# EAGLE design FM Transmitter (EAGLE 9.6.2)
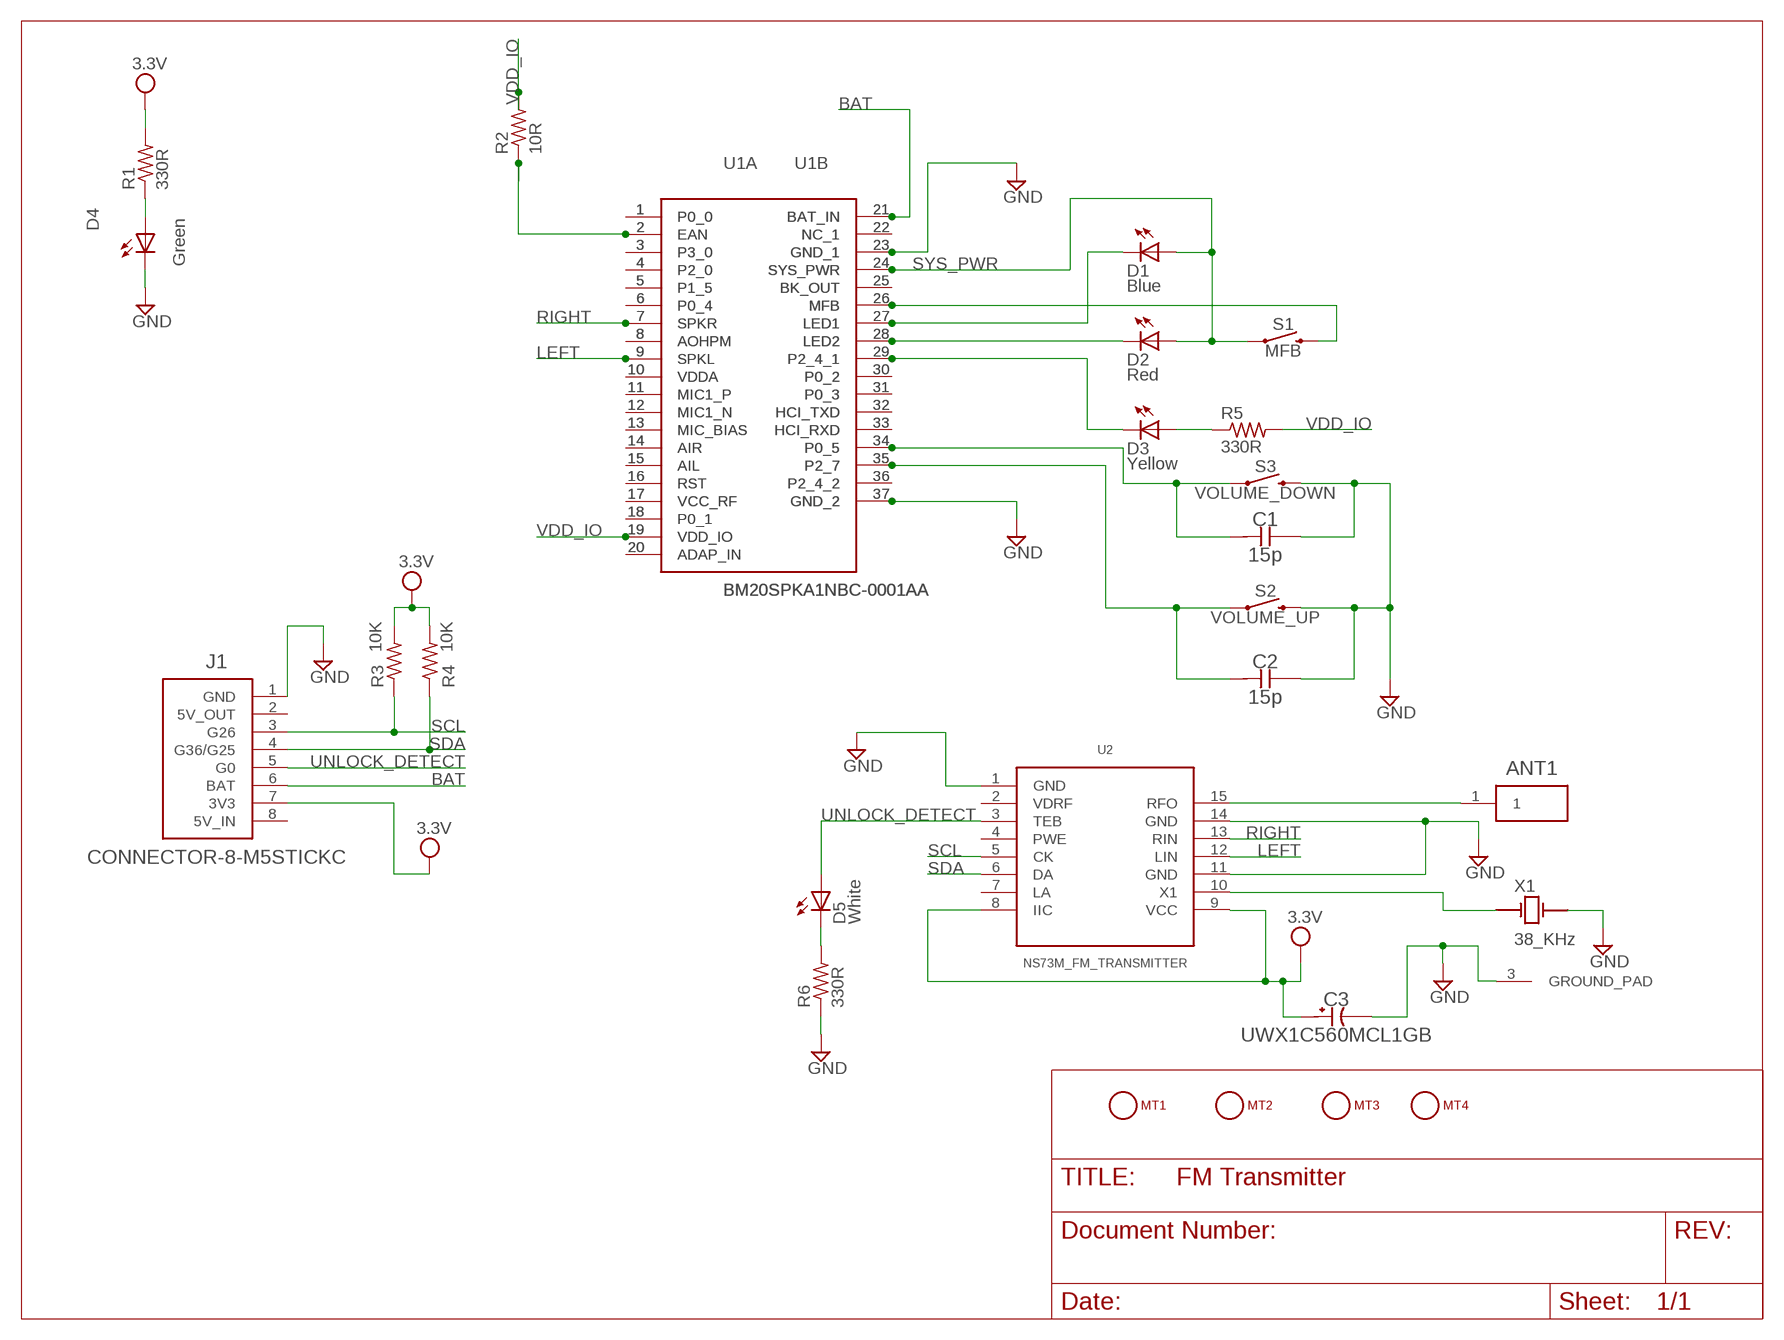
[diagram p0: schematic, sheet 1]

## Parts
ANT1  CONNECTOR-1  [ESQ-101-XX-X-S]
C1  15p  CAPACITOR-0805  [CAPC2012X140N]
C2  15p  CAPACITOR-0805  [CAPC2012X140N]
C3  UWX1C560MCL1GB  CAPACITOR_POLARIZED-6.3MM  [PCAP_6.3X5.4-ELECT-M]
D1  Blue  LED5MM  [LED5MM]
D2  Red  LED5MM  [LED5MM]
D3  Yellow  LED5MM  [LED5MM]
D4  Green  LED5MM  [LED5MM]
D5  White  LED5MM  [LED5MM]
J1  CONNECTOR-8-M5STICKC  [ESQ-108-XX-X-S]
MT1  MOUNTING_HOLE-125_250_ROUND  [MT_125_250]
MT2  MOUNTING_HOLE-125_250_ROUND  [MT_125_250]
MT3  MOUNTING_HOLE-125_250_ROUND  [MT_125_250]
MT4  MOUNTING_HOLE-125_250_ROUND  [MT_125_250]
R1  330R  R-US_R0805  [R0805]
R2  10R  R-US_R0805  [R0805]
R3  10K  R-US_R0805  [R0805]
R4  10K  R-US_R0805  [R0805]
R5  330R  R-US_R0805  [R0805]
R6  330R  R-US_R0805  [R0805]
S1  MFB  MOMENTARY-SWITCH-SPST-PTH-6.0MM  [TACTILE_SWITCH_PTH_6.0MM]
S2  VOLUME_UP  MOMENTARY-SWITCH-SPST-PTH-6.0MM  [TACTILE_SWITCH_PTH_6.0MM]
S3  VOLUME_DOWN  MOMENTARY-SWITCH-SPST-PTH-6.0MM  [TACTILE_SWITCH_PTH_6.0MM]
U1A  BM20SPKA1NBC-0001AA  [BM20SPKA1NBC0001AA]
U1B  BM20SPKA1NBC-0001AA  [BM20SPKA1NBC0001AA]
U2  NS73M_FM_TRANSMITTER  [NS73M]
X1  38_KHz  XTAL_38_KHZ_GROUND_PAD  [XTAL-WITH-GROUND-PAD]

## Nets
3.3V: C3.1 J1.7(3V3) R1.2 R3.2 R4.2 U2.8(IIC) U2.9(VCC)
BAT: J1.6(BAT) U1A.21(BAT_IN) U1B.21(BAT_IN)
GND: C1.2 C2.2 C3.2 D4.K(C) J1.1(GND) R6.1 S2.3 S3.3 U1A.23(GND_1) U1A.37(GND_2) U1B.23(GND_1) U1B.37(GND_2) U2.1(GND) U2.11(GND) U2.14(GND) X1.2 X1.3(GROUND_PAD)
LEFT: U1A.9(SPKL) U1B.9(SPKL) U2.12(LIN)
N$1: ANT1.1 U2.15(RFO)
N$2: D4.A R1.1
N$3: R2.1 U1A.2(EAN) U1B.2(EAN)
N$4: D3.K(C) U1A.29(P2_4_1) U1B.29(P2_4_1)
N$5: D2.K(C) U1A.28(LED2) U1B.28(LED2)
N$6: D1.K(C) U1A.27(LED1) U1B.27(LED1)
N$7: D3.A R5.1
N$8: D5.K(C) R6.2
N$9: S1.3 U1A.26(MFB) U1B.26(MFB)
N$10: U2.10(X1) X1.1
N$11: C2.1 S2.1 U1A.35(P2_7) U1B.35(P2_7)
N$12: C1.1 S3.1 U1A.34(P0_5) U1B.34(P0_5)
N$14: U1A.1(P0_0) U1B.1(P0_0)
N$15: U1A.3(P3_0) U1B.3(P3_0)
N$16: U1A.4(P2_0) U1B.4(P2_0)
N$17: U1A.5(P1_5) U1B.5(P1_5)
N$18: U1A.6(P0_4) U1B.6(P0_4)
N$19: U1A.8(AOHPM) U1B.8(AOHPM)
N$20: U1A.10(VDDA) U1B.10(VDDA)
N$21: U1A.11(MIC1_P) U1B.11(MIC1_P)
N$22: U1A.12(MIC1_N) U1B.12(MIC1_N)
N$23: U1A.13(MIC_BIAS) U1B.13(MIC_BIAS)
N$24: U1A.14(AIR) U1B.14(AIR)
N$25: U1A.15(AIL) U1B.15(AIL)
N$26: U1A.16(RST) U1B.16(RST)
N$27: U1A.17(VCC_RF) U1B.17(VCC_RF)
N$28: U1A.18(P0_1) U1B.18(P0_1)
N$29: U1A.20(ADAP_IN) U1B.20(ADAP_IN)
N$30: U1A.22(NC_1) U1B.22(NC_1)
N$31: U1A.25(BK_OUT) U1B.25(BK_OUT)
N$32: U1A.30(P0_2) U1B.30(P0_2)
N$33: U1A.31(P0_3) U1B.31(P0_3)
N$34: U1A.32(HCI_TXD) U1B.32(HCI_TXD)
N$35: U1A.33(HCI_RXD) U1B.33(HCI_RXD)
N$36: U1A.36(P2_4_2) U1B.36(P2_4_2)
RIGHT: U1A.7(SPKR) U1B.7(SPKR) U2.13(RIN)
SCL: J1.3(G26) R3.1 U2.5(CK)
SDA: J1.4(G36/G25) R4.1 U2.6(DA)
SYS_PWR: D1.A D2.A S1.1 U1A.24(SYS_PWR) U1B.24(SYS_PWR)
UNLOCK_DETECT: D5.A J1.5(G0) U2.3(TEB)
VDD_IO: R2.2 R5.2 U1A.19(VDD_IO) U1B.19(VDD_IO)
Unconnected: J1.2(5V_OUT) J1.8(5V_IN) MT1.1 MT2.1 MT3.1 MT4.1 U2.2(VDRF) U2.4(PWE) U2.7(LA)

## Library data of the parts
ANT1 = eagle-library-engr-245-s22:CONNECTOR-1
C1 C2 = eagle-library-engr-245-s22:CAPACITOR
C3 = eagle-library-engr-245-s22:CAPACITOR_POLARIZED
D1-D5 = eagle-library-engr-245-s22:LED: LED OSRAM: - CHIPLED LG R971, LG N971, LY N971, LG Q971, LY Q971, LO R971, LY R971 LH N974, LH R974 LS Q976, LO Q976, LY Q976 LO Q996 - Hyper CHIPLED LW Q18S LB Q993, LB Q99A, LB R99A - SideLED LS A670, LO A670, LY A670, LG A670, LP A670 LB A673, LV A673, LT A673, LW A673 LH A674 LY A675 LS A676, LA A676, LO A676, LY A676, LW A676 LS A679, LY A679, LG A679 - Hyper Micro SIDELED® LS Y876, LA Y876, LO Y876, LY Y876 LT Y87S - SmartLED LW L88C, LW L88S LB L89C, LB L89S, LG L890 LS L89K, LO L89K, LY L89K LS L896, LA L896, LO L896, LY L896 - TOPLED LS T670, LO T670, LY T670, LG T670, LP T670 LSG T670, LSP T670, LSY T670, LOP T670, LYG T670 LG T671, LOG T671, LSG T671 LB T673, LV T673, LT T673, LW T673 LH T674 LS T676, LA T676, LO T676, LY T676, LB T676, LH T676, LSB T676, LW T676 LB T67C, LV T67C, LT T67C, LS T67K, LO T67K, LY T67K, LW E67C LS E67B, LA E67B, LO E67B, LY E67B, LB E67C, LV E67C, LT E67C LW T67C LS T679, LY T679, LG T679 LS T770, LO T770, LY T770, LG T770, LP T770 LB T773, LV T773, LT T773, LW T773 LH T774 LS E675, LA E675, LY E675, LS T675 LS T776, LA T776, LO T776, LY T776, LB T776 LHGB T686 LT T68C, LB T68C - Hyper Mini TOPLED® LB M676 - Mini TOPLED Santana® LG M470 LS M47K, LO M47K, LY M47K Source: http://www.osram.convergy.de/
J1 = eagle-library-engr-245-s22:CONNECTOR-8-M5STICKC
MT1-MT4 = eagle-library-engr-245-s22:MOUNTING_HOLE
R1-R6 = eagle-library-engr-245-s22:R-US_: RESISTOR, American symbol
S1-S3 = eagle-library-engr-245-s22:MOMENTARY-SWITCH-SPST: Momentary Switch (Pushbutton) - SPST Normally-open (NO) SPST momentary switches (buttons, pushbuttons). Variants PTH-12MM - 12mm square, through-hole Momentary Pushbutton Switch - 12mm Square <https://www.sparkfun.com/products/9190> (COM-09190) PTH-6.0MM, PTH-6.0MM-KIT - 6.0mm square, through-hole Mini Pushbutton Switch <https://www.sparkfun.com/products/97> (COM-00097) KIT package intended for soldering kit's - only one side of pads' copper is exposed. PTH-RIGHT-ANGLE-KIT - Right-angle, through-hole Right Angle Tactile Button <https://www.sparkfun.com/products/10791> - Used on SparkFun BigTime Watch Kit <https://www.sparkfun.com/products/11734> SMD-12MM - 12mm square, surface-mount Tactile Button - SMD (12mm) <https://www.sparkfun.com/products/12993> (COM-12993) Used on SparkFun PicoBoard <https://www.sparkfun.com/products/11888> SMD-4.5MM - 4.5mm Square Trackball Switch Used on SparkFun Blackberry Trackballer Breakout <https://www.sparkfun.com/products/13169> SMD-4.6MMX2.8MM - 4.60mm x 2.80mm, surface mount Used on SparkFun SAMD21 Mini Breakout <https://www.sparkfun.com/products/13664> SMD-5.2MM, SMD-5.2-REDUNDANT - 5.2mm square, surface-mount Mini Pushbutton Switch - SMD <https://www.sparkfun.com/products/8720> (COM-08720) Used on Arduino Pro Mini <https://www.sparkfun.com/products/11114> REDUNDANT package connects both switch circuits together SMD-6.0X3.5MM - 6.0 x 3.5mm, surface mount Momentary Reset Switch SMD <https://www.sparkfun.com/products/8229> (COM-08229) SMD-6.2MM-TALL - 6.2mm square, surface mount Tactile Button - SMD (6mm) <https://www.sparkfun.com/products/12992> Used on SparkFun Digital Sandbox <https://www.sparkfun.com/products/12651> SMD-RIGHT-ANGLE - Right-angle, surface mount Used on SparkFun Block for Intel® Edison - Arduino <https://www.sparkfun.com/products/13036>; PROD_ID: SWCH-08441; SF_SKU: COM-00097
U1A U1B = eagle-library-engr-245-s22:BM20SPKA1NBC-0001AA: Bluetooth Modules (802.15.1) BT 4.1 Stereo Audio No-Shield/Antenna Source: Datasheet <https://componentsearchengine.com/Datasheets/1/BM20SPKA1NBC-0001AA.pdf>; DESCRIPTION: Bluetooth Modules (802.15.1) BT 4.1 Stereo Audio No-Shield/Antenna; HEIGHT: 2.5mm; MANUFACTURER_NAME: Microchip; MANUFACTURER_PART_NUMBER: BM20SPKA1NBC-0001AA; MOUSER_PART_NUMBER: 579-SPKA1NBC-0001AA; MOUSER_PRICE-STOCK: https://www.mouser.co.uk/ProductDetail/Microchip-Technology/BM20SPKA1NBC-0001AA?qs=uus7iwvxYD8HqvnWsd76VQ%3D%3D
U2 = eagle-library-engr-245-s22:NS73M_FM_TRANSMITTER
X1 = eagle-library-engr-245-s22:XTAL_38_KHZ_GROUND_PAD

## Board
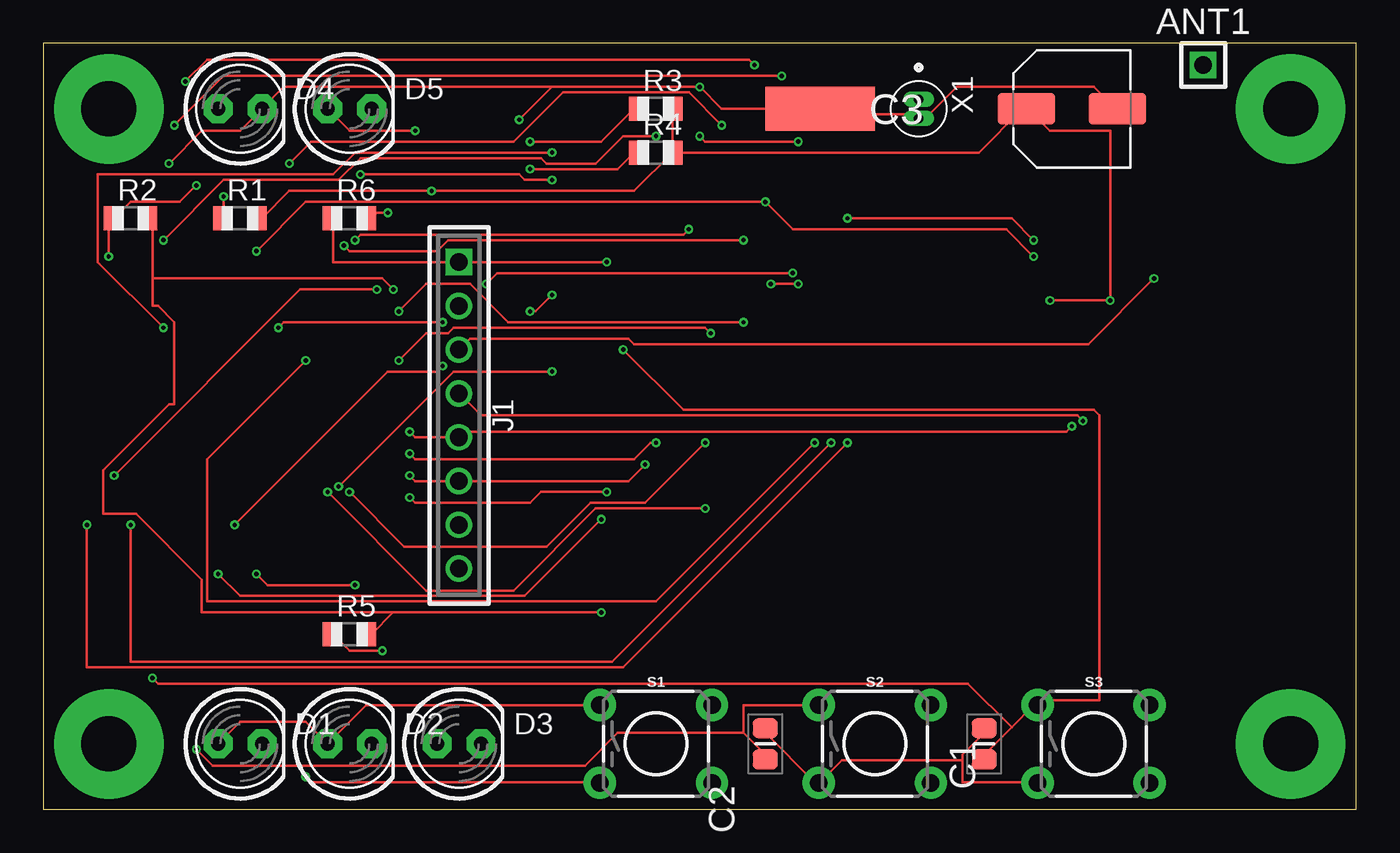
[diagram p1: board, top side]
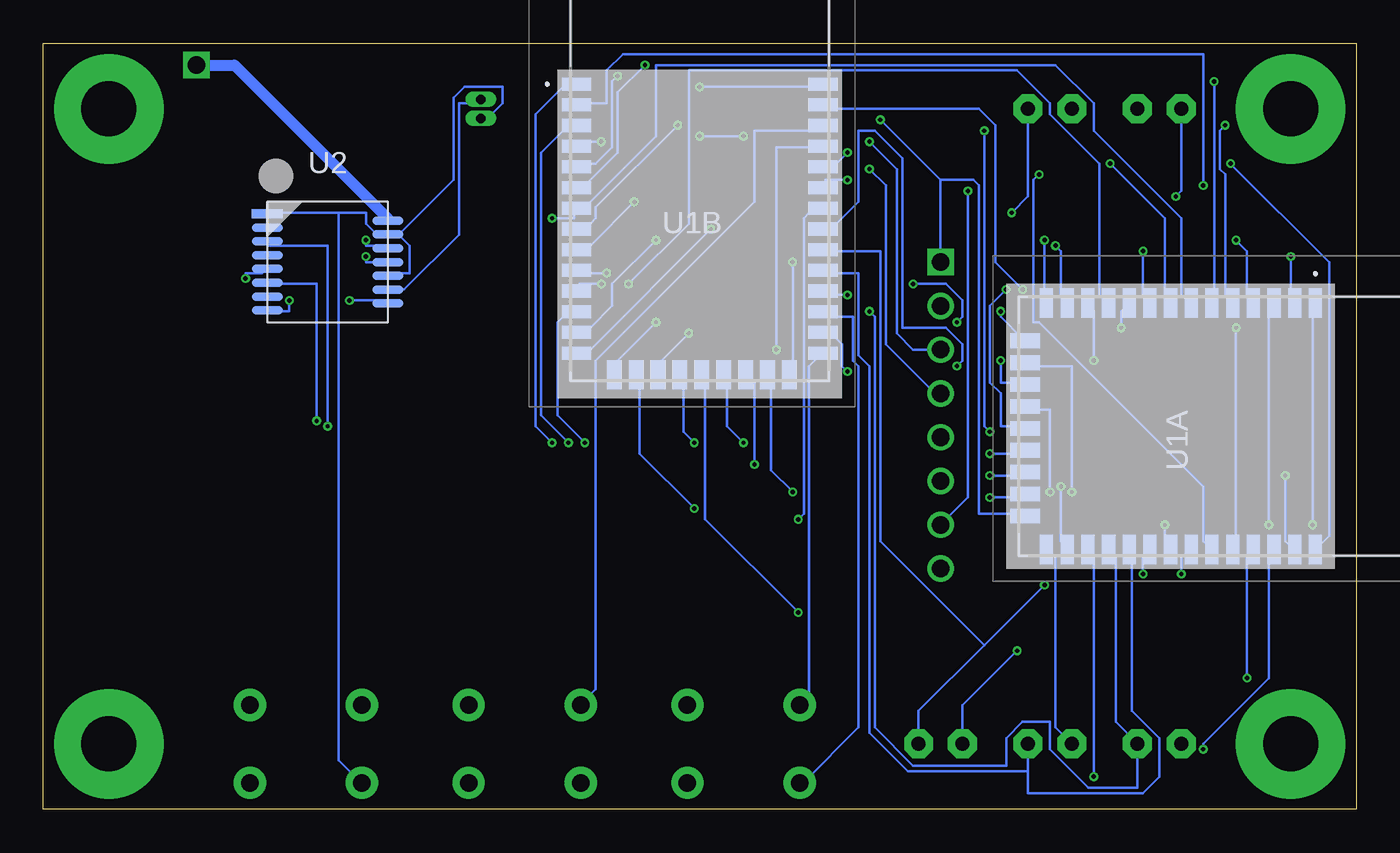
[diagram p2: board, bottom side, seen from below]

Size 76.2 x 44.45 mm. Coordinates in mm from the lower left corner, seen from the top.
Outline: 0,0 76.2,0 76.2,44.45 0,44.45 0,0
Copper layers (1*16): Top 0.035559375mm / dielectric 1.6mm / Bottom 0.035559375mm
Design rules "oshpark-2layer *": minimum track width 6mil, minimum drill 10mil, track to track 6mil, track to pad 6mil, pad to pad 6mil, via to via 6mil, smd to smd 6mil, copper to edge 15mil, drill to drill 6mil, minimum pad ring 5mil, minimum via ring 5mil, stop-mask expansion 2.5mil, vias tented up to drill 20mil, thermal gap 10mil

### Footprints (pad centres in the part's own frame; a part is rotated, then mirrored left to right if it is on the bottom)
ESQ-101-XX-X-S = drill 1.016 pad 1.524 square: 1 0,0
CAPC2012X140N = smd 1.15 x 1.45: 1 -0.9,0; 2 0.9,0
PCAP_6.3X5.4-ELECT-M = smd 3.32 x 1.82: 1 -2.645,0; 2 2.645,0
LED5MM = drill 0.813 pad 1.676 octagon: A -1.27,0; K 1.27,0
ESQ-108-XX-X-S = drill 1.016 pad 1.524 square: 1 0,0 | drill 1.016 pad 1.524: 2 2.54,0; 3 5.08,0; 4 7.62,0; 5 10.16,0; 6 12.7,0; 7 15.24,0; 8 17.78,0
MT_125_250 = drill 3.175 pad 6.35: 1 0,0
R0805 = smd 1.1 x 1.4: 1 -1,0; 2 1,0
TACTILE_SWITCH_PTH_6.0MM = drill 1.016 pad 1.88: 1 -3.251,2.261; 2 3.251,2.261; 3 -3.251,-2.261; 4 3.251,-2.261
BM20SPKA1NBC0001AA = smd 1.7 x 0.76: 1 -7.15,2.7; 2 -7.15,1.5; 3 -7.15,0.3; 4 -7.15,-0.9; 5 -7.15,-2.1; 6 -7.15,-3.3; 7 -7.15,-4.5; 8 -7.15,-5.7; 9 -7.15,-6.9; 10 -7.15,-8.1; 11 -7.15,-9.3; 12 -7.15,-10.5; 13 -7.15,-11.7; 14 -7.15,-12.9; 24 7.15,-12.9; 25 7.15,-11.7; 26 7.15,-10.5; 27 7.15,-9.3; 28 7.15,-8.1; 29 7.15,-6.9; 30 7.15,-5.7; 31 7.15,-4.5; 32 7.15,-3.3; 33 7.15,-2.1; 34 7.15,-0.9; 35 7.15,0.3; 36 7.15,1.5; 37 7.15,2.7 | smd 0.85 x 1.7: 15 -4.96,-14.15; 16 -3.69,-14.15; 17 -2.42,-14.15; 18 -1.15,-14.15; 19 0.12,-14.15; 20 1.39,-14.15; 21 2.66,-14.15; 22 3.93,-14.15; 23 5.2,-14.15
NS73M = smd 1.8 x 0.5: 1 -3.5,2.8; 2 -3.5,2; 3 -3.5,1.2; 4 -3.5,0.4; 5 -3.5,-0.4; 6 -3.5,-1.2; 7 -3.5,-2; 8 -3.5,-2.8; 9 3.5,-2.4; 10 3.5,-1.6; 11 3.5,-0.8; 12 3.5,0; 13 3.5,0.8; 14 3.5,1.6; 15 3.5,2.4
XTAL-WITH-GROUND-PAD = drill 0.55 pad 0.889 long: 1 -0.55,0; 2 0.55,0 | smd 2.54 x 6.35: 3 0,-5.715

### Placement (x,y rotation side)
ANT1  67.31,43.18 0 top
C1  54.61,3.81 90 top
C2  41.91,3.81 90 top
C3  59.69,40.64 0 top
D1  11.43,3.81 0 top
D2  17.78,3.81 0 top
D3  24.13,3.81 0 top
D4  11.43,40.64 0 top
D5  17.78,40.64 0 top
J1  24.13,31.75 270 top
MT1  3.81,3.81 0 top
MT2  72.39,3.81 0 top
MT3  72.39,40.64 0 top
MT4  3.81,40.64 0 top
R1  11.43,34.29 0 top
R2  5.08,34.29 0 top
R3  35.56,40.64 0 top
R4  35.56,38.1 0 top
R5  17.78,10.16 0 top
R6  17.78,34.29 0 top
S1  35.56,3.81 0 top
S2  48.26,3.81 0 top
S3  60.96,3.81 0 top
U1A  5.08,22.23 270 bottom
U1B  38.1,39.37 0 bottom
U2  59.69,31.75 0 bottom
X1  50.8,40.64 270 top

### Tracks (layer width: path | path; a pad name or v marks a point on that pad's centre or on a via)
3.3V  (via drill 0.25)
  Top 0.152: v58.42,29.53 v61.91,29.53 61.91,39.37 58.42,39.37 57.15,40.64 C3.1 56.83,40.64 54.29,38.1 R4.2 36.51,38.1 | 36.51,38.1 34.29,35.88 v22.54,35.88 14.29,35.88 12.7,34.29 R1.2 | 36.51,38.1 36.51,40.64 R3.2
  Bottom 0.152: v61.91,29.53 61.91,28.89 63.18,28.89 U2.8 | v58.42,29.53 56.2,29.53 U2.9 | J1.7 22.54,18.1 v22.54,35.88
BAT  (via drill 0.25)
  Top 0.152: v21.27,19.37 21.59,19.05 J1.6 33.97,19.05 v34.92,20
  Bottom 0.152: v21.27,19.37 19.37,19.37 U1A.21 | v34.92,20 34.92,24.77 35.24,25.08 U1B.21
GND  (via drill 0.25)
  Top 0.152: v7.3,37.47 9.21,39.37 11.43,39.37 D4.K 13.97,41.91 29.53,41.91 | R6.1 16.83,34.29 16.83,31.75 J1.1 v32.7,31.75 | C2.2 41.91,4.45 44.77,1.59 S2.3 45.09,1.59 46.35,2.86 53.34,2.86 | 53.34,2.86 53.34,1.59 57.47,1.59 S3.3 | 53.34,2.86 53.34,3.17 54.61,4.45 C1.2 | 50.8,40.32 45.4,40.32 X1.3 39.37,40.64 v38.1,41.91 29.53,41.91 | 50.8,40.32 51.44,40.32 53.02,41.91 60.96,41.91 62.23,40.64 C3.2 | 50.8,40.32 X1.2 | 29.53,41.91 v27.62,40.01
  Bottom 0.152: v7.3,37.47 1.59,31.75 1.59,15.88 2.22,15.24 U1A.37 | 24.13,36.51 22.23,36.51 21.91,36.2 21.91,17.14 19.37,17.14 U1A.23 | J1.1 24.13,36.51 | v32.7,31.75 32.7,25.4 U1B.23 | 55.56,33.34 54.93,32.7 54.93,31.11 55.88,31.11 U2.11 | 55.56,33.34 55.88,33.34 U2.14 | 59.05,34.61 57.47,34.61 57.47,33.97 56.83,33.34 56.2,33.34 U2.14 | 59.05,34.61 63.18,34.61 U2.1 | v38.1,41.91 31.11,41.91 U1B.37 | 55.56,33.34 52.39,36.51 52.39,41.27 51.75,41.91 49.53,41.91 49.53,40.96 50.16,40.32 50.8,40.32 X1.2 | 55.56,33.34 U2.14 | 59.05,34.61 59.05,2.86 57.78,1.59 S3.3 | v27.62,40.01 24.13,36.51
LEFT  (via drill 0.25)
  Top 0.152: v12.38,32.38 15.24,35.24 v41.91,35.24 43.5,33.66 55.88,33.66 v57.47,32.07
  Bottom 0.152: v12.38,32.38 12.38,29.84 12.06,29.53 U1A.9 | v41.91,35.24 44.45,32.7 45.09,32.7 U1B.9 | U2.12 57.47,31.75 v57.47,32.07
N$1
  Bottom 0.152: 56.2,34.29 U2.15
  Bottom 0.635: 56.2,34.29 65.09,43.18 ANT1.1
N$2  (via drill 0.25)
  Top 0.152: v10.48,35.56 10.48,34.29 R1.1
  Bottom 0.152: v10.48,35.56 10.16,35.88 D4.A
N$3  (via drill 0.25)
  Top 0.152: v3.81,32.07 3.81,34.29 R2.1 4.13,34.29 5.08,35.24 7.94,35.24 v8.89,36.2
  Bottom 0.152: v3.81,32.07 3.81,29.53 U1A.2 | v8.89,36.2 8.89,43.81 42.55,43.81 43.5,42.86 43.5,40.96 45.09,40.96 U1B.2
N$4  (via drill 0.25)
  Top 0.152: v12.38,13.65 13.02,13.02 v18.1,13.02
  Bottom 0.152: v12.38,13.65 12.38,14.61 12.06,14.92 U1A.29 | 21.59,9.53 25.4,5.71 D3.K | 21.59,9.53 v18.1,13.02 | 21.59,9.53 27.62,15.56 27.62,32.38 30.8,32.38 U1B.29
N$5
  Bottom 0.152: D2.K 19.05,2.22 | 19.05,2.22 19.05,0.95 12.38,0.95 11.43,1.91 11.43,4.13 13.02,5.71 13.02,14.92 U1A.28 | 19.05,2.22 26.04,2.22 28.26,4.45 28.26,25.72 28.89,26.35 28.89,31.11 30.8,31.11 U1B.28
N$6  (via drill 0.25)
  Top 0.152: v29.53,29.84 28.57,28.89 v28.26,28.89
  Bottom 0.152: U1A.27 14.29,14.92 13.97,14.61 13.97,5.08 D1.K 12.7,1.27 15.56,1.27 17.78,3.49 17.78,5.08 19.37,5.08 20.32,4.13 20.32,2.54 25.72,2.54 27.94,4.76 27.94,28.57 v28.26,28.89 | v29.53,29.84 30.8,29.84 U1B.27
N$7  (via drill 0.25)
  Top 0.152: v19.68,9.21 17.78,9.21 16.83,10.16 R5.1
  Bottom 0.152: v19.68,9.21 22.86,6.03 D3.A
N$8  (via drill 0.25)
  Top 0.152: v20,34.61 19.37,34.61 19.05,34.29 R6.2
  Bottom 0.152: v20,34.61 19.05,35.56 D5.K
N$9  (via drill 0.25)
  Top 0.152: v15.24,1.91 15.56,1.59 32.07,1.59 S1.3
  Bottom 0.152: v15.24,1.91 15.24,14.61 15.56,14.92 U1A.26 | U1B.26 30.8,28.57 29.21,28.57 29.21,26.04 28.89,25.72 28.89,4.76 32.07,1.59 S1.3
N$10
  Bottom 0.152: X1.1 50.8,40.96 52.07,40.96 52.07,33.34 55.24,30.16 55.88,30.16 U2.10
N$11  (via drill 0.25)
  Top 0.152: 40.64,4.45 41.91,3.17 C2.1 | 40.64,4.45 40.64,6.03 44.77,6.03 S2.1 | v8.89,3.49 9.84,2.54 31.43,2.54 33.34,4.45 40.64,4.45
  Bottom 0.152: v8.89,3.49 8.89,3.81 5.08,7.62 5.08,14.92 U1A.35 | U1B.35 31.11,39.37 34.92,39.37 34.92,35.24 44.13,26.04 44.13,6.99 44.77,6.35 S2.1
N$12  (via drill 0.25)
  Top 0.152: 56.2,4.76 57.47,6.03 S3.1 57.78,6.35 61.28,6.35 61.28,22.86 60.96,23.18 37.15,23.18 v33.66,26.67 | 56.2,4.76 54.61,3.17 C1.1 | v6.35,7.62 6.67,7.3 53.66,7.3 56.2,4.76
  Bottom 0.152: v6.35,7.62 6.35,14.61 6.03,14.92 U1A.34 | v33.66,26.67 33.66,38.42 31.11,38.42 U1B.34
N$14  (via drill 0.25)
  Top 0.152: v2.54,16.51 2.54,8.26 33.66,8.26 v46.67,21.27
  Bottom 0.152: v2.54,16.51 2.54,29.21 U1A.1 | v46.67,21.27 47.62,22.23 47.62,40.32 46.04,41.91 45.4,41.91 U1B.1
N$15  (via drill 0.25)
  Top 0.152: v5.08,16.51 5.08,8.57 33.02,8.57 v45.72,21.27
  Bottom 0.152: v5.08,16.51 5.08,29.21 U1A.3 | v45.72,21.27 47.31,22.86 47.31,38.1 46.04,39.37 45.4,39.37 U1B.3
N$16  (via drill 0.25)
  Top 0.152: v6.99,33.02 10.48,36.51 17.14,36.51 18.41,37.78 28.89,37.78 29.21,37.47 32.07,37.47 33.66,39.05 v35.56,39.05 | v38.1,39.05 38.42,38.73 v43.81,38.73
  Bottom 0.152: v6.99,33.02 6.35,32.38 6.35,29.84 6.03,29.53 U1A.4 | v38.1,39.05 v35.56,39.05 | v43.81,38.73 45.09,38.73 U1B.4
N$17  (via drill 0.25)
  Top 0.152: v7.62,39.69 10.48,42.55 v42.86,42.55
  Bottom 0.152: v7.62,39.69 7.94,39.37 7.94,37.15 7.62,36.83 7.62,29.84 7.3,29.53 U1A.5 | v42.86,42.55 43.18,42.23 43.18,38.42 44.13,37.47 45.09,37.47 U1B.5
N$18  (via drill 0.25)
  Top 0.152: v8.26,42.23 9.53,43.5 40.96,43.5 v41.27,43.18
  Bottom 0.152: v8.26,42.23 8.26,29.53 U1A.6 | v41.27,43.18 42.86,41.59 42.86,38.1 45.09,35.88 U1B.6
N$19  (via drill 0.25)
  Top 0.152: v14.29,37.47 15.56,38.73 27.3,38.73 30.16,41.59 37.47,41.59 v39.37,39.69
  Bottom 0.152: v14.29,37.47 11.11,34.29 11.11,29.84 10.79,29.53 U1A.8 | v39.37,39.69 44.13,34.92 44.13,34.29 44.45,33.97 45.09,33.97 U1B.8
N$20  (via drill 0.25)
  Top 0.152: v13.65,27.94 13.97,28.26 v23.18,28.26 | v25.72,30.48 26.35,31.11 v43.5,31.11
  Bottom 0.152: v13.65,27.94 13.65,28.89 13.34,29.21 U1A.10 | v23.18,28.26 22.86,28.57 22.86,29.53 23.81,30.48 v25.72,30.48 | v43.5,31.11 45.09,31.11 U1B.10
N$21  (via drill 0.25)
  Top 0.152: v43.81,30.48 v42.23,30.48
  Bottom 0.152: v42.23,30.48 38.73,33.97 38.73,42.86 19.68,42.86 17.78,40.96 17.78,40.32 14.92,37.47 14.92,29.84 14.61,29.53 U1A.11 | v43.81,30.48 45.09,30.48 45.09,30.16 U1B.11
N$22  (via drill 0.25)
  Top 0.152: v15.24,26.04 9.53,20.32 9.53,12.06 35.56,12.06 v44.77,21.27
  Bottom 0.152: v15.24,26.04 15.24,28.89 15.56,29.21 U1A.12 | v44.77,21.27 46.35,22.86 46.35,28.26 46.04,28.57 45.4,28.57 U1B.12
N$23  (via drill 0.25)
  Top 0.152: v17.46,32.7 17.78,32.38 22.86,32.38 23.5,33.02 v40.64,33.02
  Bottom 0.152: v17.46,32.7 17.14,32.38 17.14,29.84 16.83,29.53 U1A.13 | v40.64,33.02 43.18,30.48 43.18,29.21 44.45,27.94 45.09,27.94 U1B.13
N$24  (via drill 0.25)
  Top 0.152: v18.1,33.02 18.41,33.34 37.15,33.34 v37.47,33.66
  Bottom 0.152: v18.1,33.02 18.1,29.53 U1A.14 | v37.47,33.66 44.45,26.67 45.09,26.67 U1B.14
N$25  (via drill 0.25)
  Top 0.152: v20.64,28.89 22.23,30.48 24.77,30.48 26.99,28.26 v40.64,28.26
  Bottom 0.152: v20.64,28.89 20.64,28.57 19.37,27.3 U1A.15 | v40.64,28.26 42.86,26.04 42.86,25.4 U1B.15
N$26  (via drill 0.25)
  Top 0.152: v16.51,18.41 22.23,12.7 27.3,12.7 32.07,17.46 v38.42,17.46
  Bottom 0.152: v16.51,18.41 16.51,25.72 19.05,25.72 U1A.16 | v38.42,17.46 41.59,20.64 41.59,25.08 U1B.16
N$27  (via drill 0.25)
  Top 0.152: v20.64,26.04 22.23,27.62 23.5,27.62 23.81,27.94 38.42,27.94 v38.73,27.62
  Bottom 0.152: v20.64,26.04 20.64,24.77 19.37,24.77 U1A.17 | v38.73,27.62 40.32,26.04 40.32,25.4 U1B.17
N$28  (via drill 0.25)
  Top 0.152: v17.78,18.41 20.95,15.24 29.21,15.24 31.75,17.78 34.92,17.78 v38.42,21.27
  Bottom 0.152: v17.78,18.41 17.78,23.18 19.05,23.18 U1A.18 | v38.42,21.27 39.05,21.91 39.05,25.08 U1B.18
N$29  (via drill 0.25)
  Top 0.152: v21.27,20.64 21.59,20.32 34.29,20.32 35.24,21.27 v35.56,21.27
  Bottom 0.152: v21.27,20.64 19.37,20.64 U1A.20 | v35.56,21.27 36.51,22.23 36.51,25.08 U1B.20
N$30  (via drill 0.25)
  Top 0.152: v21.27,18.1 21.59,17.78 28.26,17.78 28.89,18.41 v32.7,18.41
  Bottom 0.152: v21.27,18.1 19.37,18.1 U1A.22 | v32.7,18.41 33.97,19.68 33.97,25.08 U1B.22
N$31  (via drill 0.25)
  Top 0.152: v17.14,18.73 23.81,25.4 v29.53,25.4
  Bottom 0.152: v17.14,18.73 17.14,15.56 16.83,15.24 U1A.25 | v29.53,25.4 29.84,25.72 29.84,26.99 30.8,27.94 U1B.25
N$32  (via drill 0.25)
  Top 0.152: v11.11,16.51 20,25.4 22.86,25.4 v23.18,25.72
  Bottom 0.152: v11.11,16.51 11.11,15.56 10.79,15.24 U1A.30 | v23.18,25.72 22.86,26.04 22.86,26.99 23.81,27.94 26.35,27.94 26.35,37.78 27.94,39.37 28.89,39.37 28.89,35.24 30.16,33.97 30.8,33.97 U1B.30
N$33  (via drill 0.25)
  Top 0.152: v10.16,13.65 11.43,12.38 27.94,12.38 v32.38,16.83
  Bottom 0.152: v10.16,13.65 10.16,14.61 9.84,14.92 U1A.31 | v32.38,16.83 32.07,17.14 32.07,34.29 31.75,34.61 31.11,34.61 U1B.31
N$34  (via drill 0.25)
  Top 0.152: v18.41,36.83 27.62,36.83 27.94,36.51 v29.53,36.51
  Bottom 0.152: v18.41,36.83 18.73,36.51 18.73,28.26 18.41,28.26 8.89,18.73 8.89,15.56 8.57,15.24 U1A.32 | v29.53,36.51 30.8,36.51 30.8,36.2 U1B.32
N$35  (via drill 0.25)
  Top 0.152: v6.99,27.94 3.17,31.75 3.17,36.83 16.83,36.83 18.1,38.1 v29.53,38.1
  Bottom 0.152: v6.99,27.94 6.99,15.24 U1A.33 | v29.53,38.1 30.16,37.47 30.8,37.47 U1B.33
N$36  (via drill 0.25)
  Top 0.152: v4.13,19.37 14.92,30.16 v19.37,30.16
  Bottom 0.152: v4.13,19.37 4.13,15.56 3.81,15.24 U1A.36 | v19.37,30.16 20.95,31.75 20.95,39.69 21.91,40.64 30.8,40.64 U1B.36
RIGHT  (via drill 0.25)
  Top 0.152: v57.47,33.02 56.2,34.29 v46.67,34.29
  Bottom 0.152: U1A.7 9.84,29.53 10.16,29.84 10.16,34.29 15.24,39.37 15.24,40.96 17.46,43.18 40.64,43.18 40.64,39.05 45.09,34.61 U1B.7 45.4,34.61 45.4,34.29 v46.67,34.29 | v57.47,33.02 57.47,32.7 56.2,32.7 U2.13
SCL  (via drill 0.25)
  Top 0.152: v28.26,38.73 32.38,38.73 34.29,40.64 R3.1 | v64.45,30.8 60.64,26.99 34.29,26.99 33.97,27.3 24.77,27.3 J1.3
  Bottom 0.152: v28.26,38.73 26.67,37.15 26.67,27.62 25.72,26.67 J1.3 | v64.45,30.8 64.45,31.11 63.5,31.11 U2.5
SDA  (via drill 0.25)
  Top 0.152: v28.26,37.15 33.34,37.15 34.29,38.1 R4.1 | v60.33,22.54 60.01,22.86 25.4,22.86 J1.4
  Bottom 0.152: v28.26,37.15 27.3,36.2 27.3,26.99 24.45,24.13 J1.4 | v60.33,22.54 60.33,30.48 63.18,30.48 U2.6
SYS_PWR
  Top 0.152: D1.A 11.43,5.08 15.24,5.08 D2.A 18.73,6.03 32.07,6.03 S1.1
  Bottom 0.152: D2.A 17.46,4.76 17.46,14.61 17.78,14.92 U1A.24 | U1B.24 31.11,26.35 31.75,25.72 31.75,6.67 32.07,6.35 S1.1
UNLOCK_DETECT  (via drill 0.25)
  Top 0.152: v59.69,22.23 59.37,21.91 24.45,21.91 J1.5 21.59,21.59 v21.27,21.91 | D5.A 17.78,39.37 v21.59,39.37
  Bottom 0.152: v59.69,22.23 59.69,32.7 63.18,32.7 U2.3 | v21.59,39.37 21.59,22.23 v21.27,21.91
VDD_IO  (via drill 0.25)
  Top 0.152: 20.32,11.43 19.05,10.16 R5.2 | v32.38,11.43 20.32,11.43 | 6.35,30.8 6.35,29.21 6.67,29.21 7.62,28.26 7.62,23.5 7.3,23.5 3.49,19.68 3.49,17.14 5.4,17.14 9.21,13.34 9.21,11.43 20.32,11.43 | 6.35,30.8 6.35,34.29 R2.2 | v20.32,30.16 19.68,30.8 6.35,30.8
  Bottom 0.152: v32.38,11.43 37.78,16.83 37.78,25.08 U1B.19 | v20.32,30.16 21.27,29.21 21.27,24.77 20.64,24.13 20.64,22.23 19.37,22.23 U1A.19